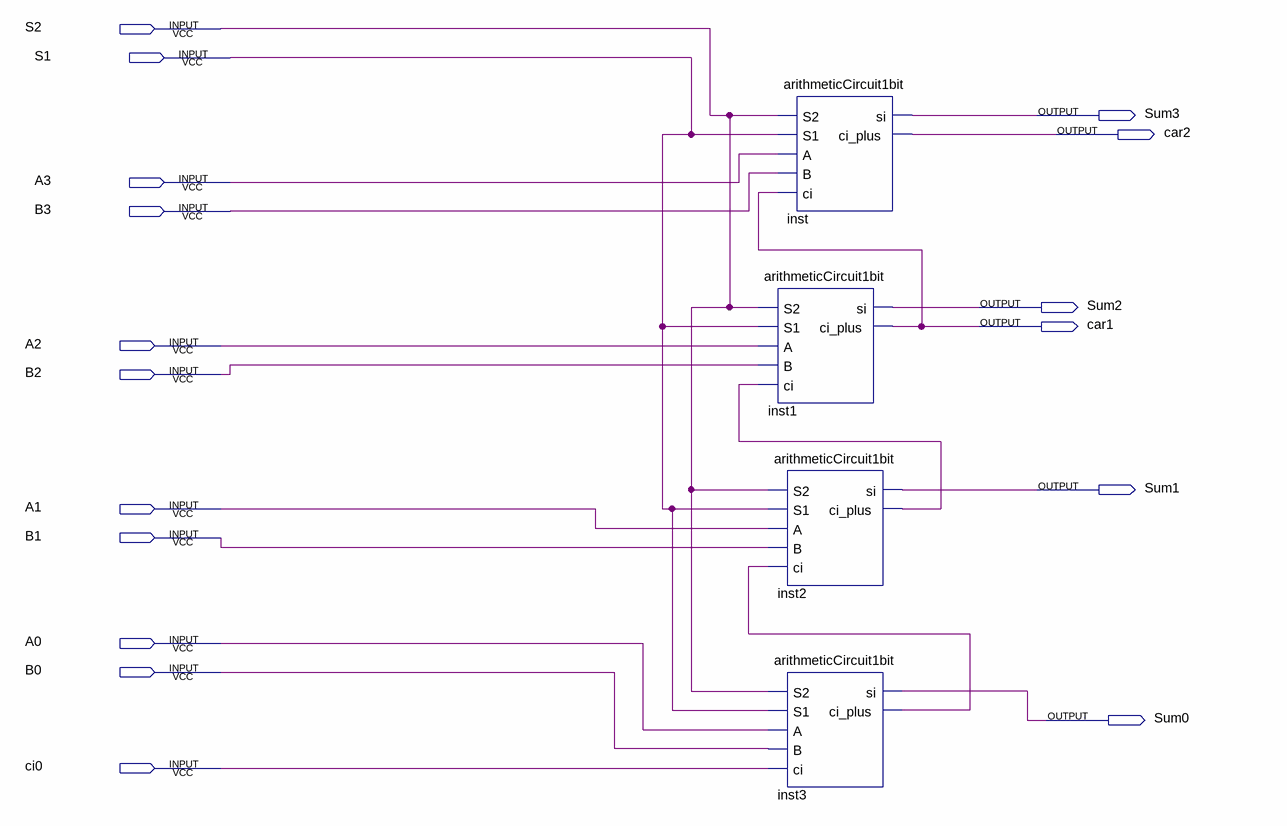
[diagram p0: schematic sheet]
// Quartus schematic arithmeticCircuit4bit.bdf as structural Verilog: 4 symbols, 17 pins
module arithmeticCircuit4bit (
  input  S2,
  input  S1,
  input  A3,
  input  B3,
  input  A2,
  input  B2,
  input  A1,
  input  B1,
  input  A0,
  input  B0,
  input  ci0,
  output Sum3,
  output car2,
  output Sum2,
  output car1,
  output Sum1,
  output Sum0
);

  wire inst2_ci_plus, inst3_ci_plus;

  arithmeticCircuit1bit inst (.S2(S2), .S1(S1), .A(A3), .B(B3), .ci(car1), .si(Sum3), .ci_plus(car2));
  arithmeticCircuit1bit inst1 (.S2(S2), .S1(S1), .A(A2), .B(B2), .ci(inst2_ci_plus), .si(Sum2), .ci_plus(car1));
  arithmeticCircuit1bit inst2 (
    .S2(S2), .S1(S1), .A(A1), .B(B1), .ci(inst3_ci_plus), .si(Sum1), .ci_plus(inst2_ci_plus));
  arithmeticCircuit1bit inst3 (.S2(S2), .S1(S1), .A(A0), .B(B0), .ci(ci0), .si(Sum0), .ci_plus(inst3_ci_plus));
endmodule
